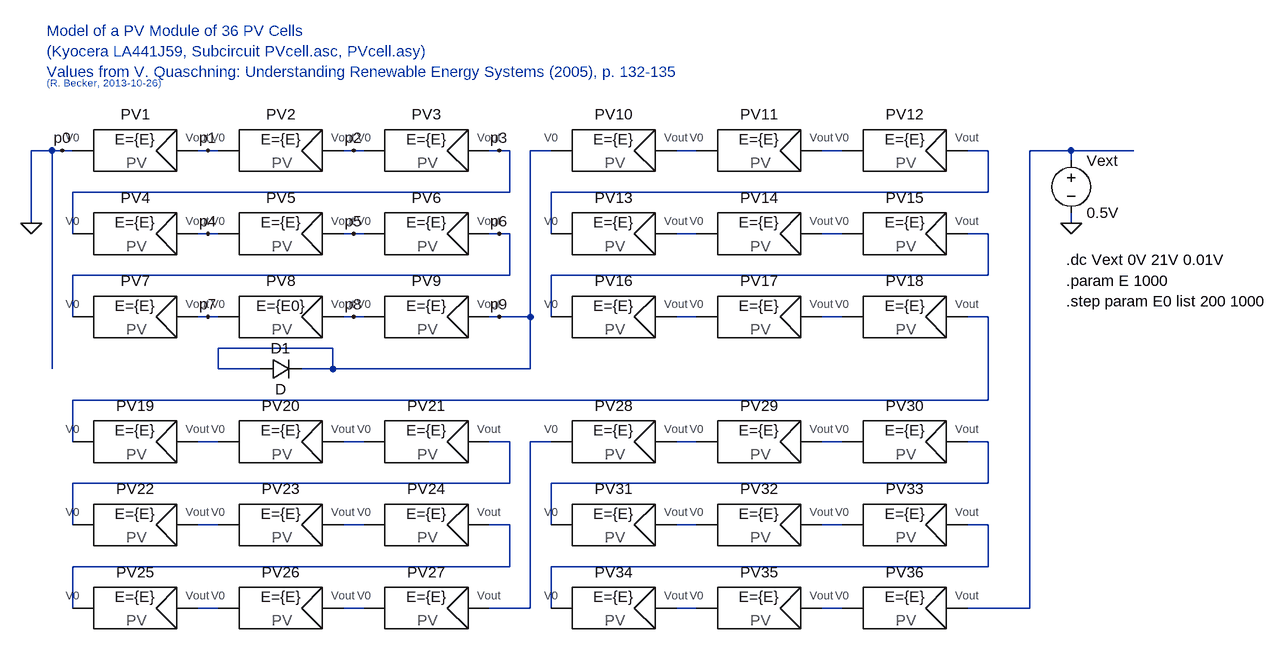
[diagram p0: schematic PVmodule_36Cells.asc]
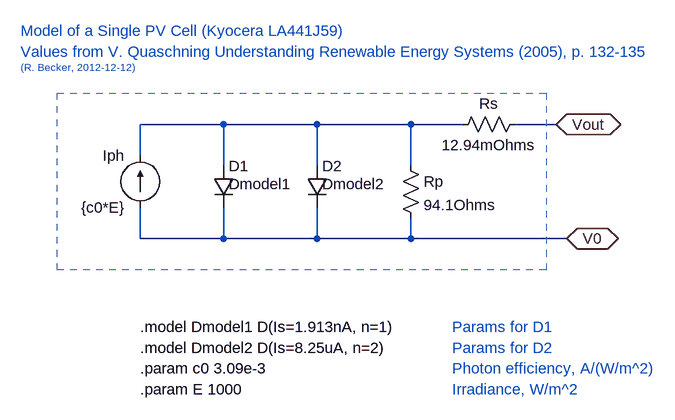
[diagram p1: sub-circuit pvcell.asc]
PVmodule_36Cells.asc, the LTspice schematic file:
Version 4
SHEET 1 2048 908
WIRE -32 160 -64 160
WIRE -16 160 -32 160
WIRE 0 160 -16 160
WIRE 208 160 192 160
WIRE 224 160 208 160
WIRE 432 160 416 160
WIRE 448 160 432 160
WIRE 656 160 640 160
WIRE 672 160 656 160
WIRE 736 160 704 160
WIRE 960 160 928 160
WIRE 1184 160 1152 160
WIRE 1408 160 1376 160
WIRE 1536 160 1472 160
WIRE 1632 160 1536 160
WIRE 1536 176 1536 160
WIRE 672 224 672 160
WIRE 672 224 0 224
WIRE 1408 224 1408 160
WIRE 1408 224 736 224
WIRE -64 272 -64 160
WIRE 1536 272 1536 256
WIRE 0 288 0 224
WIRE 208 288 192 288
WIRE 224 288 208 288
WIRE 432 288 416 288
WIRE 448 288 432 288
WIRE 656 288 640 288
WIRE 672 288 656 288
WIRE 736 288 736 224
WIRE 960 288 928 288
WIRE 1184 288 1152 288
WIRE 1408 288 1376 288
WIRE 672 352 672 288
WIRE 672 352 0 352
WIRE 1408 352 1408 288
WIRE 1408 352 736 352
WIRE 0 416 0 352
WIRE 208 416 192 416
WIRE 224 416 208 416
WIRE 432 416 416 416
WIRE 448 416 432 416
WIRE 656 416 640 416
WIRE 704 416 704 160
WIRE 704 416 656 416
WIRE 736 416 736 352
WIRE 960 416 928 416
WIRE 1184 416 1152 416
WIRE 1408 416 1376 416
WIRE 400 464 224 464
WIRE -32 496 -32 160
WIRE 224 496 224 464
WIRE 288 496 224 496
WIRE 400 496 400 464
WIRE 400 496 352 496
WIRE 704 496 704 416
WIRE 704 496 400 496
WIRE 1408 544 1408 416
WIRE 1408 544 0 544
WIRE 0 608 0 544
WIRE 224 608 192 608
WIRE 448 608 416 608
WIRE 672 608 640 608
WIRE 736 608 704 608
WIRE 960 608 928 608
WIRE 1184 608 1152 608
WIRE 1408 608 1376 608
WIRE 672 672 672 608
WIRE 672 672 0 672
WIRE 1408 672 1408 608
WIRE 1408 672 736 672
WIRE 0 736 0 672
WIRE 224 736 192 736
WIRE 448 736 416 736
WIRE 672 736 640 736
WIRE 736 736 736 672
WIRE 960 736 928 736
WIRE 1184 736 1152 736
WIRE 1408 736 1376 736
WIRE 672 800 672 736
WIRE 672 800 0 800
WIRE 1408 800 1408 736
WIRE 1408 800 736 800
WIRE 0 864 0 800
WIRE 224 864 192 864
WIRE 448 864 416 864
WIRE 704 864 704 608
WIRE 704 864 640 864
WIRE 736 864 736 800
WIRE 960 864 928 864
WIRE 1184 864 1152 864
WIRE 1472 864 1472 160
WIRE 1472 864 1376 864
FLAG -64 272 0
FLAG 1536 272 0
FLAG -16 160 p0
FLAG 208 160 p1
FLAG 432 160 p2
FLAG 656 160 p3
FLAG 208 288 p4
FLAG 432 288 p5
FLAG 656 288 p6
FLAG 208 416 p7
FLAG 432 416 p8
FLAG 656 416 p9
SYMBOL PVcell 96 160 R0
WINDOW 39 0 -2 Bottom 2
SYMATTR SpiceLine E={E}
SYMATTR InstName PV1
SYMATTR SpiceModel ""
SYMBOL voltage 1536 160 R0
WINDOW 123 0 0 Left 2
WINDOW 39 0 0 Left 2
SYMATTR InstName Vext
SYMATTR Value 0.5V
SYMBOL PVcell 320 160 R0
WINDOW 39 0 -2 Bottom 2
SYMATTR SpiceLine E={E}
SYMATTR InstName PV2
SYMATTR SpiceModel ""
SYMBOL PVcell 544 160 R0
WINDOW 39 0 -2 Bottom 2
SYMATTR SpiceLine E={E}
SYMATTR InstName PV3
SYMATTR SpiceModel ""
SYMBOL PVcell 96 288 R0
WINDOW 39 0 -2 Bottom 2
SYMATTR SpiceLine E={E}
SYMATTR InstName PV4
SYMATTR SpiceModel ""
SYMBOL PVcell 320 288 R0
WINDOW 39 0 -2 Bottom 2
SYMATTR SpiceLine E={E}
SYMATTR InstName PV5
SYMATTR SpiceModel ""
SYMBOL PVcell 544 288 R0
WINDOW 39 0 -2 Bottom 2
SYMATTR SpiceLine E={E}
SYMATTR InstName PV6
SYMATTR SpiceModel ""
SYMBOL PVcell 96 416 R0
WINDOW 39 0 -2 Bottom 2
SYMATTR SpiceLine E={E}
SYMATTR InstName PV7
SYMATTR SpiceModel ""
SYMBOL PVcell 320 416 R0
WINDOW 39 0 -2 Bottom 2
SYMATTR SpiceLine E={E0}
SYMATTR InstName PV8
SYMATTR SpiceModel ""
SYMBOL PVcell 544 416 R0
WINDOW 39 0 -2 Bottom 2
SYMATTR SpiceLine E={E}
SYMATTR InstName PV9
SYMATTR SpiceModel ""
SYMBOL PVcell 832 160 R0
WINDOW 39 0 -2 Bottom 2
SYMATTR SpiceLine E={E}
SYMATTR InstName PV10
SYMATTR SpiceModel ""
SYMBOL PVcell 1056 160 R0
WINDOW 39 0 -2 Bottom 2
SYMATTR SpiceLine E={E}
SYMATTR InstName PV11
SYMATTR SpiceModel ""
SYMBOL PVcell 1280 160 R0
WINDOW 39 0 -2 Bottom 2
SYMATTR SpiceLine E={E}
SYMATTR InstName PV12
SYMATTR SpiceModel ""
SYMBOL PVcell 832 288 R0
WINDOW 39 0 -2 Bottom 2
SYMATTR SpiceLine E={E}
SYMATTR InstName PV13
SYMATTR SpiceModel ""
SYMBOL PVcell 1056 288 R0
WINDOW 39 0 -2 Bottom 2
SYMATTR SpiceLine E={E}
SYMATTR InstName PV14
SYMATTR SpiceModel ""
SYMBOL PVcell 1280 288 R0
WINDOW 39 0 -2 Bottom 2
SYMATTR SpiceLine E={E}
SYMATTR InstName PV15
SYMATTR SpiceModel ""
SYMBOL PVcell 832 416 R0
WINDOW 39 0 -2 Bottom 2
SYMATTR SpiceLine E={E}
SYMATTR InstName PV16
SYMATTR SpiceModel ""
SYMBOL PVcell 1056 416 R0
WINDOW 39 0 -2 Bottom 2
SYMATTR SpiceLine E={E}
SYMATTR InstName PV17
SYMATTR SpiceModel ""
SYMBOL PVcell 1280 416 R0
WINDOW 39 0 -2 Bottom 2
SYMATTR SpiceLine E={E}
SYMATTR InstName PV18
SYMATTR SpiceModel ""
SYMBOL PVcell 96 608 R0
WINDOW 39 0 -2 Bottom 2
SYMATTR SpiceLine E={E}
SYMATTR InstName PV19
SYMATTR SpiceModel ""
SYMBOL PVcell 320 608 R0
WINDOW 39 0 -2 Bottom 2
SYMATTR SpiceLine E={E}
SYMATTR InstName PV20
SYMATTR SpiceModel ""
SYMBOL PVcell 544 608 R0
WINDOW 39 0 -2 Bottom 2
SYMATTR SpiceLine E={E}
SYMATTR InstName PV21
SYMATTR SpiceModel ""
SYMBOL PVcell 96 736 R0
WINDOW 39 0 -2 Bottom 2
SYMATTR SpiceLine E={E}
SYMATTR InstName PV22
SYMATTR SpiceModel ""
SYMBOL PVcell 320 736 R0
WINDOW 39 0 -2 Bottom 2
SYMATTR SpiceLine E={E}
SYMATTR InstName PV23
SYMATTR SpiceModel ""
SYMBOL PVcell 544 736 R0
WINDOW 39 0 -2 Bottom 2
SYMATTR SpiceLine E={E}
SYMATTR InstName PV24
SYMATTR SpiceModel ""
SYMBOL PVcell 96 864 R0
WINDOW 39 0 -2 Bottom 2
SYMATTR SpiceLine E={E}
SYMATTR InstName PV25
SYMATTR SpiceModel ""
SYMBOL PVcell 320 864 R0
WINDOW 39 0 -2 Bottom 2
SYMATTR SpiceLine E={E}
SYMATTR InstName PV26
SYMATTR SpiceModel ""
SYMBOL PVcell 544 864 R0
WINDOW 39 0 -2 Bottom 2
SYMATTR SpiceLine E={E}
SYMATTR InstName PV27
SYMATTR SpiceModel ""
SYMBOL PVcell 832 608 R0
WINDOW 39 0 -2 Bottom 2
SYMATTR SpiceLine E={E}
SYMATTR InstName PV28
SYMATTR SpiceModel ""
SYMBOL PVcell 1056 608 R0
WINDOW 39 0 -2 Bottom 2
SYMATTR SpiceLine E={E}
SYMATTR InstName PV29
SYMATTR SpiceModel ""
SYMBOL PVcell 1280 608 R0
WINDOW 39 0 -2 Bottom 2
SYMATTR SpiceLine E={E}
SYMATTR InstName PV30
SYMATTR SpiceModel ""
SYMBOL PVcell 832 736 R0
WINDOW 39 0 -2 Bottom 2
SYMATTR SpiceLine E={E}
SYMATTR InstName PV31
SYMATTR SpiceModel ""
SYMBOL PVcell 1056 736 R0
WINDOW 39 0 -2 Bottom 2
SYMATTR SpiceLine E={E}
SYMATTR InstName PV32
SYMATTR SpiceModel ""
SYMBOL PVcell 1280 736 R0
WINDOW 39 0 -2 Bottom 2
SYMATTR SpiceLine E={E}
SYMATTR InstName PV33
SYMATTR SpiceModel ""
SYMBOL PVcell 832 864 R0
WINDOW 39 0 -2 Bottom 2
SYMATTR SpiceLine E={E}
SYMATTR InstName PV34
SYMATTR SpiceModel ""
SYMBOL PVcell 1056 864 R0
WINDOW 39 0 -2 Bottom 2
SYMATTR SpiceLine E={E}
SYMATTR InstName PV35
SYMATTR SpiceModel ""
SYMBOL PVcell 1280 864 R0
WINDOW 39 0 -2 Bottom 2
SYMATTR SpiceLine E={E}
SYMATTR InstName PV36
SYMATTR SpiceModel ""
SYMBOL diode 288 512 R270
WINDOW 0 32 32 VTop 2
WINDOW 3 0 32 VBottom 2
SYMATTR InstName D1
TEXT 1528 328 Left 2 !.dc Vext 0V 21V 0.01V
TEXT 1528 392 Left 2 !.step param E0 list 200 1000
TEXT -40 -24 Left 2 ;Model of a PV Module of 36 PV Cells \n(Kyocera LA441J59, Subcircuit PVcell.asc, PVcell.asy)\nValues from V. Quaschning: Understanding Renewable Energy Systems (2005), p. 132-135
TEXT -40 56 Left 1 ;(R. Becker, 2013-10-26)
TEXT 1528 360 Left 2 !.param E 1000

pvcell.asc, the sub-circuit schematic file:
Version 4
SHEET 1 880 680
WIRE 0 32 -128 32
WIRE 144 32 0 32
WIRE 288 32 144 32
WIRE 368 32 288 32
WIRE 512 32 448 32
WIRE -128 80 -128 32
WIRE 0 96 0 32
WIRE 144 96 144 32
WIRE 288 96 288 32
WIRE -128 208 -128 160
WIRE 0 208 0 160
WIRE 0 208 -128 208
WIRE 144 208 144 160
WIRE 144 208 0 208
WIRE 288 208 288 176
WIRE 288 208 144 208
WIRE 528 208 288 208
FLAG 512 32 Vout
IOPIN 512 32 BiDir
FLAG 528 208 V0
IOPIN 528 208 BiDir
SYMBOL diode -16 96 R0
WINDOW 3 24 28 Left 2
SYMATTR Value Dmodel1
SYMATTR InstName D1
SYMBOL current -128 160 R180
WINDOW 0 24 80 Left 2
WINDOW 3 24 0 Left 2
SYMATTR InstName Iph
SYMATTR Value {c0*E}
SYMBOL diode 128 96 R0
WINDOW 3 24 28 Left 2
SYMATTR Value Dmodel2
SYMATTR InstName D2
SYMBOL res 272 80 R0
SYMATTR InstName Rp
SYMATTR Value 94.1Ohms
SYMBOL res 464 16 R90
WINDOW 0 0 56 VBottom 2
WINDOW 3 32 56 VTop 2
SYMATTR InstName Rs
SYMATTR Value 12.94mOhms
TEXT -128 344 Left 2 !.model Dmodel1 D(Is=1.913nA, n=1)
TEXT -128 376 Left 2 !.model Dmodel2 D(Is=8.25uA, n=2)
TEXT -128 408 Left 2 !.param c0 3.09e-3
TEXT -312 -80 Left 2 ;Values from V. Quaschning Understanding Renewable Energy Systems (2005), p. 132-135
TEXT -312 -112 Left 2 ;Model of a Single PV Cell (Kyocera LA441J59)
TEXT -312 -56 Left 1 ;(R. Becker, 2012-12-12)
TEXT -128 440 Left 2 !.param E 1000
TEXT 352 440 Left 2 ;Irradiance, W/m^2
TEXT 352 408 Left 2 ;Photon efficiency, A/(W/m^2)
TEXT 352 344 Left 2 ;Params for D1
TEXT 352 376 Left 2 ;Params for D2
RECTANGLE Normal 496 256 -256 -16 1

The netlist it stands for:
* PVmodule_36Cells.asc
XPV1 0 p1 pvcell params: E={E}
Vext N004 0 0.5V
XPV2 p1 p2 pvcell params: E={E}
XPV3 p2 p3 pvcell params: E={E}
XPV4 p3 p4 pvcell params: E={E}
XPV5 p4 p5 pvcell params: E={E}
XPV6 p5 p6 pvcell params: E={E}
XPV7 p6 p7 pvcell params: E={E}
XPV8 p7 p8 pvcell params: E={E0}
XPV9 p8 p9 pvcell params: E={E}
XPV10 p9 N001 pvcell params: E={E}
XPV11 N001 N002 pvcell params: E={E}
XPV12 N002 N003 pvcell params: E={E}
XPV13 N003 N005 pvcell params: E={E}
XPV14 N005 N006 pvcell params: E={E}
XPV15 N006 N007 pvcell params: E={E}
XPV16 N007 N008 pvcell params: E={E}
XPV17 N008 N009 pvcell params: E={E}
XPV18 N009 N010 pvcell params: E={E}
XPV19 N010 N011 pvcell params: E={E}
XPV20 N011 N012 pvcell params: E={E}
XPV21 N012 N013 pvcell params: E={E}
XPV22 N013 N018 pvcell params: E={E}
XPV23 N018 N019 pvcell params: E={E}
XPV24 N019 N020 pvcell params: E={E}
XPV25 N020 N024 pvcell params: E={E}
XPV26 N024 N025 pvcell params: E={E}
XPV27 N025 N014 pvcell params: E={E}
XPV28 N014 N015 pvcell params: E={E}
XPV29 N015 N016 pvcell params: E={E}
XPV30 N016 N017 pvcell params: E={E}
XPV31 N017 N021 pvcell params: E={E}
XPV32 N021 N022 pvcell params: E={E}
XPV33 N022 N023 pvcell params: E={E}
XPV34 N023 N026 pvcell params: E={E}
XPV35 N026 N027 pvcell params: E={E}
XPV36 N027 N004 pvcell params: E={E}
D1 p9 p9 D

* block symbol definitions
.subckt pvcell V0 Vout
D1 N001 V0 Dmodel1
Iph V0 N001 {c0*E}
D2 N001 V0 Dmodel2
Rp N001 V0 94.1Ohms
Rs Vout N001 12.94mOhms
.model Dmodel1 D(Is=1.913nA, n=1)
.model Dmodel2 D(Is=8.25uA, n=2)
.param c0 3.09e-3
* Values from V. Quaschning Understanding Renewable Energy Systems (2005), p. 132-135
* Model of a Single PV Cell (Kyocera LA441J59)
* (R. Becker, 2012-12-12)
.param E 1000
* Irradiance, W/m^2
* Photon efficiency, A/(W/m^2)
* Params for D1
* Params for D2
.ends pvcell

.model D D
.lib standard.dio
.dc Vext 0V 21V 0.01V
.step param E0 list 200 1000
* Model of a PV Module of 36 PV Cells
* (Kyocera LA441J59, Subcircuit PVcell.asc, PVcell.asy)
* Values from V. Quaschning: Understanding Renewable Energy Systems (2005), p. 132-135
* (R. Becker, 2013-10-26)
.param E 1000
.backanno
.end